# EAGLE schematic Data Logger V3.1 (EAGLE 9.4.0)
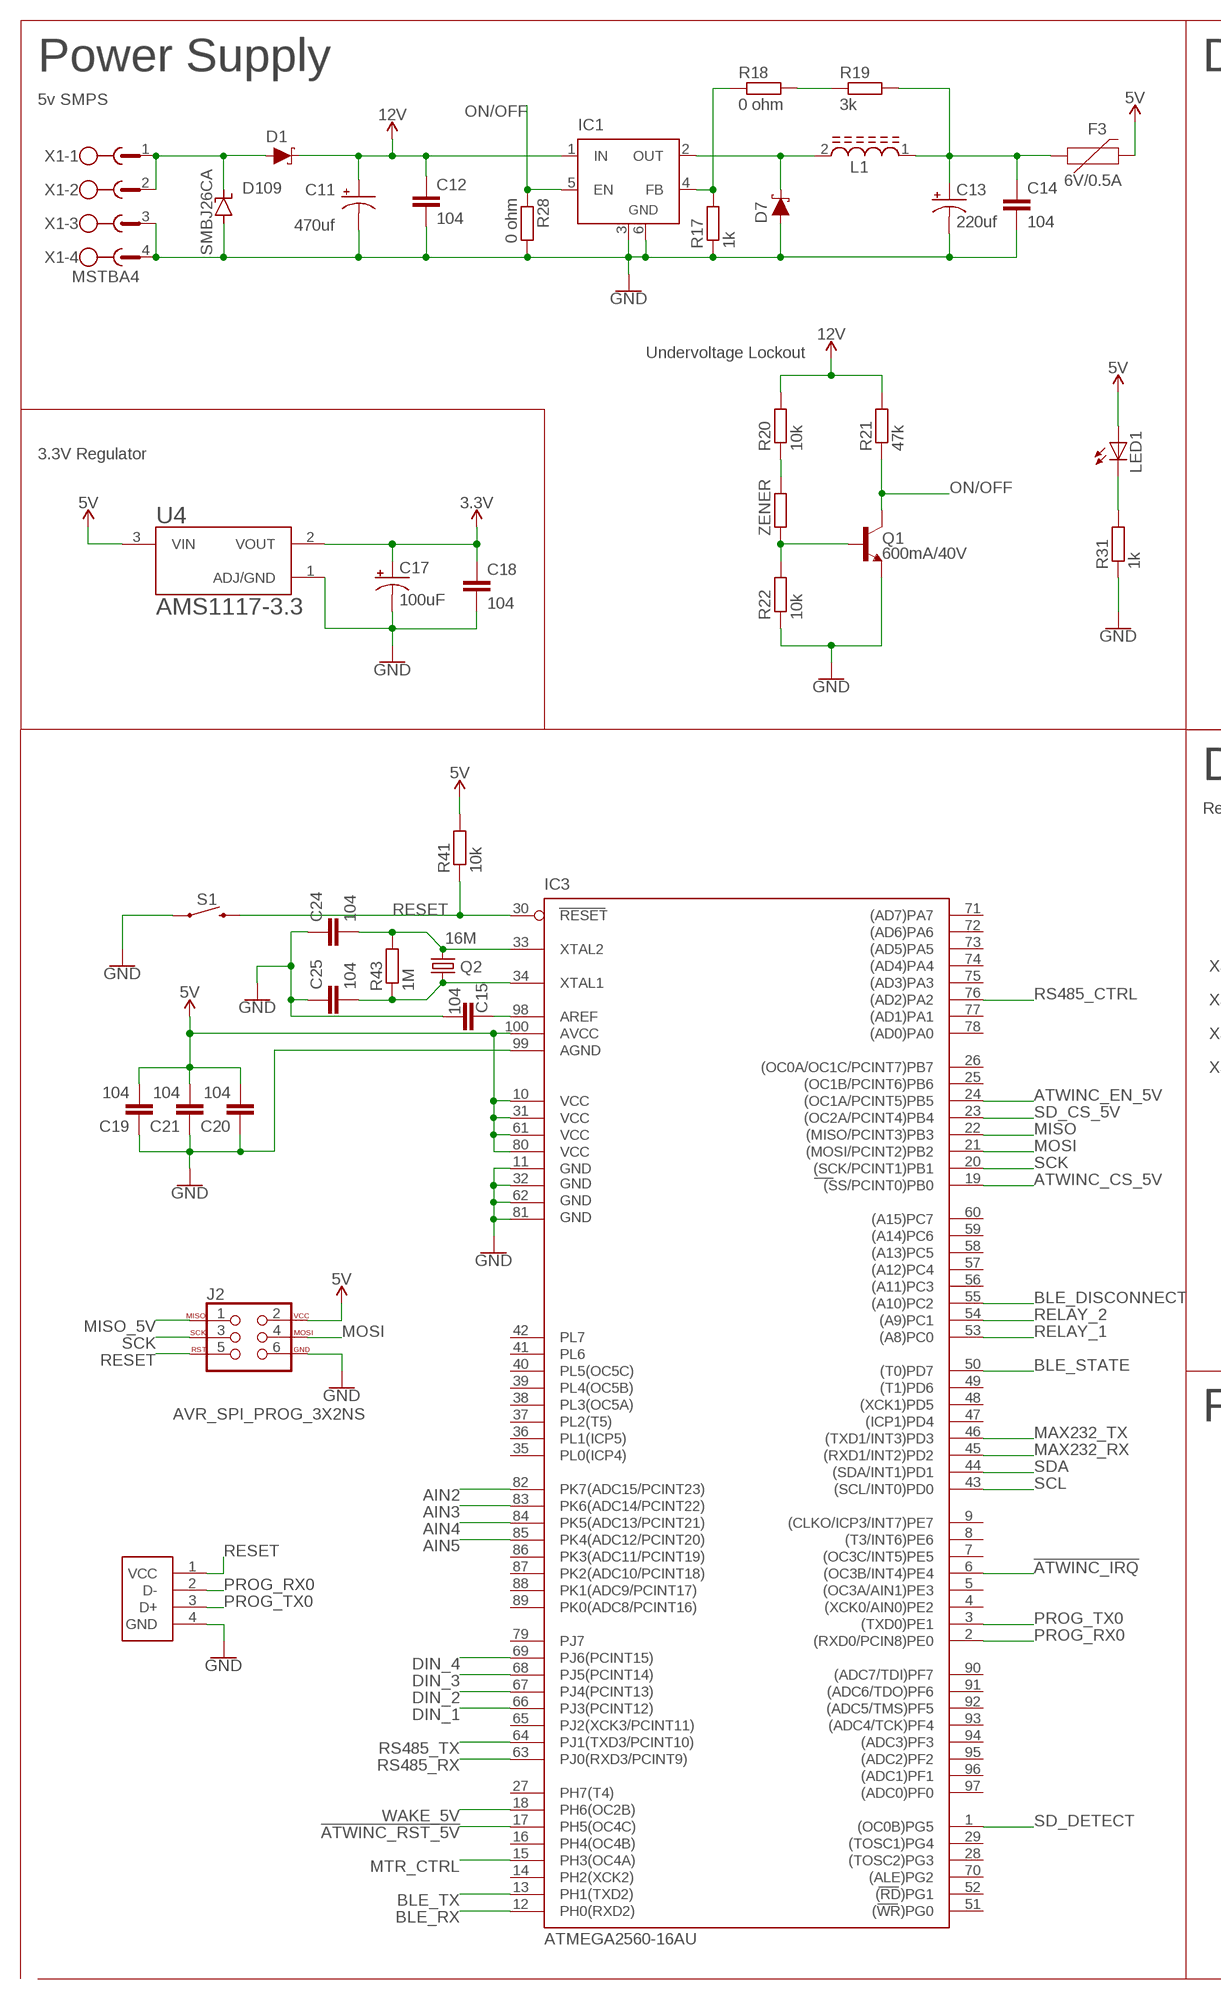
[diagram p0: schematic, sheet 1, part 1 of 3]
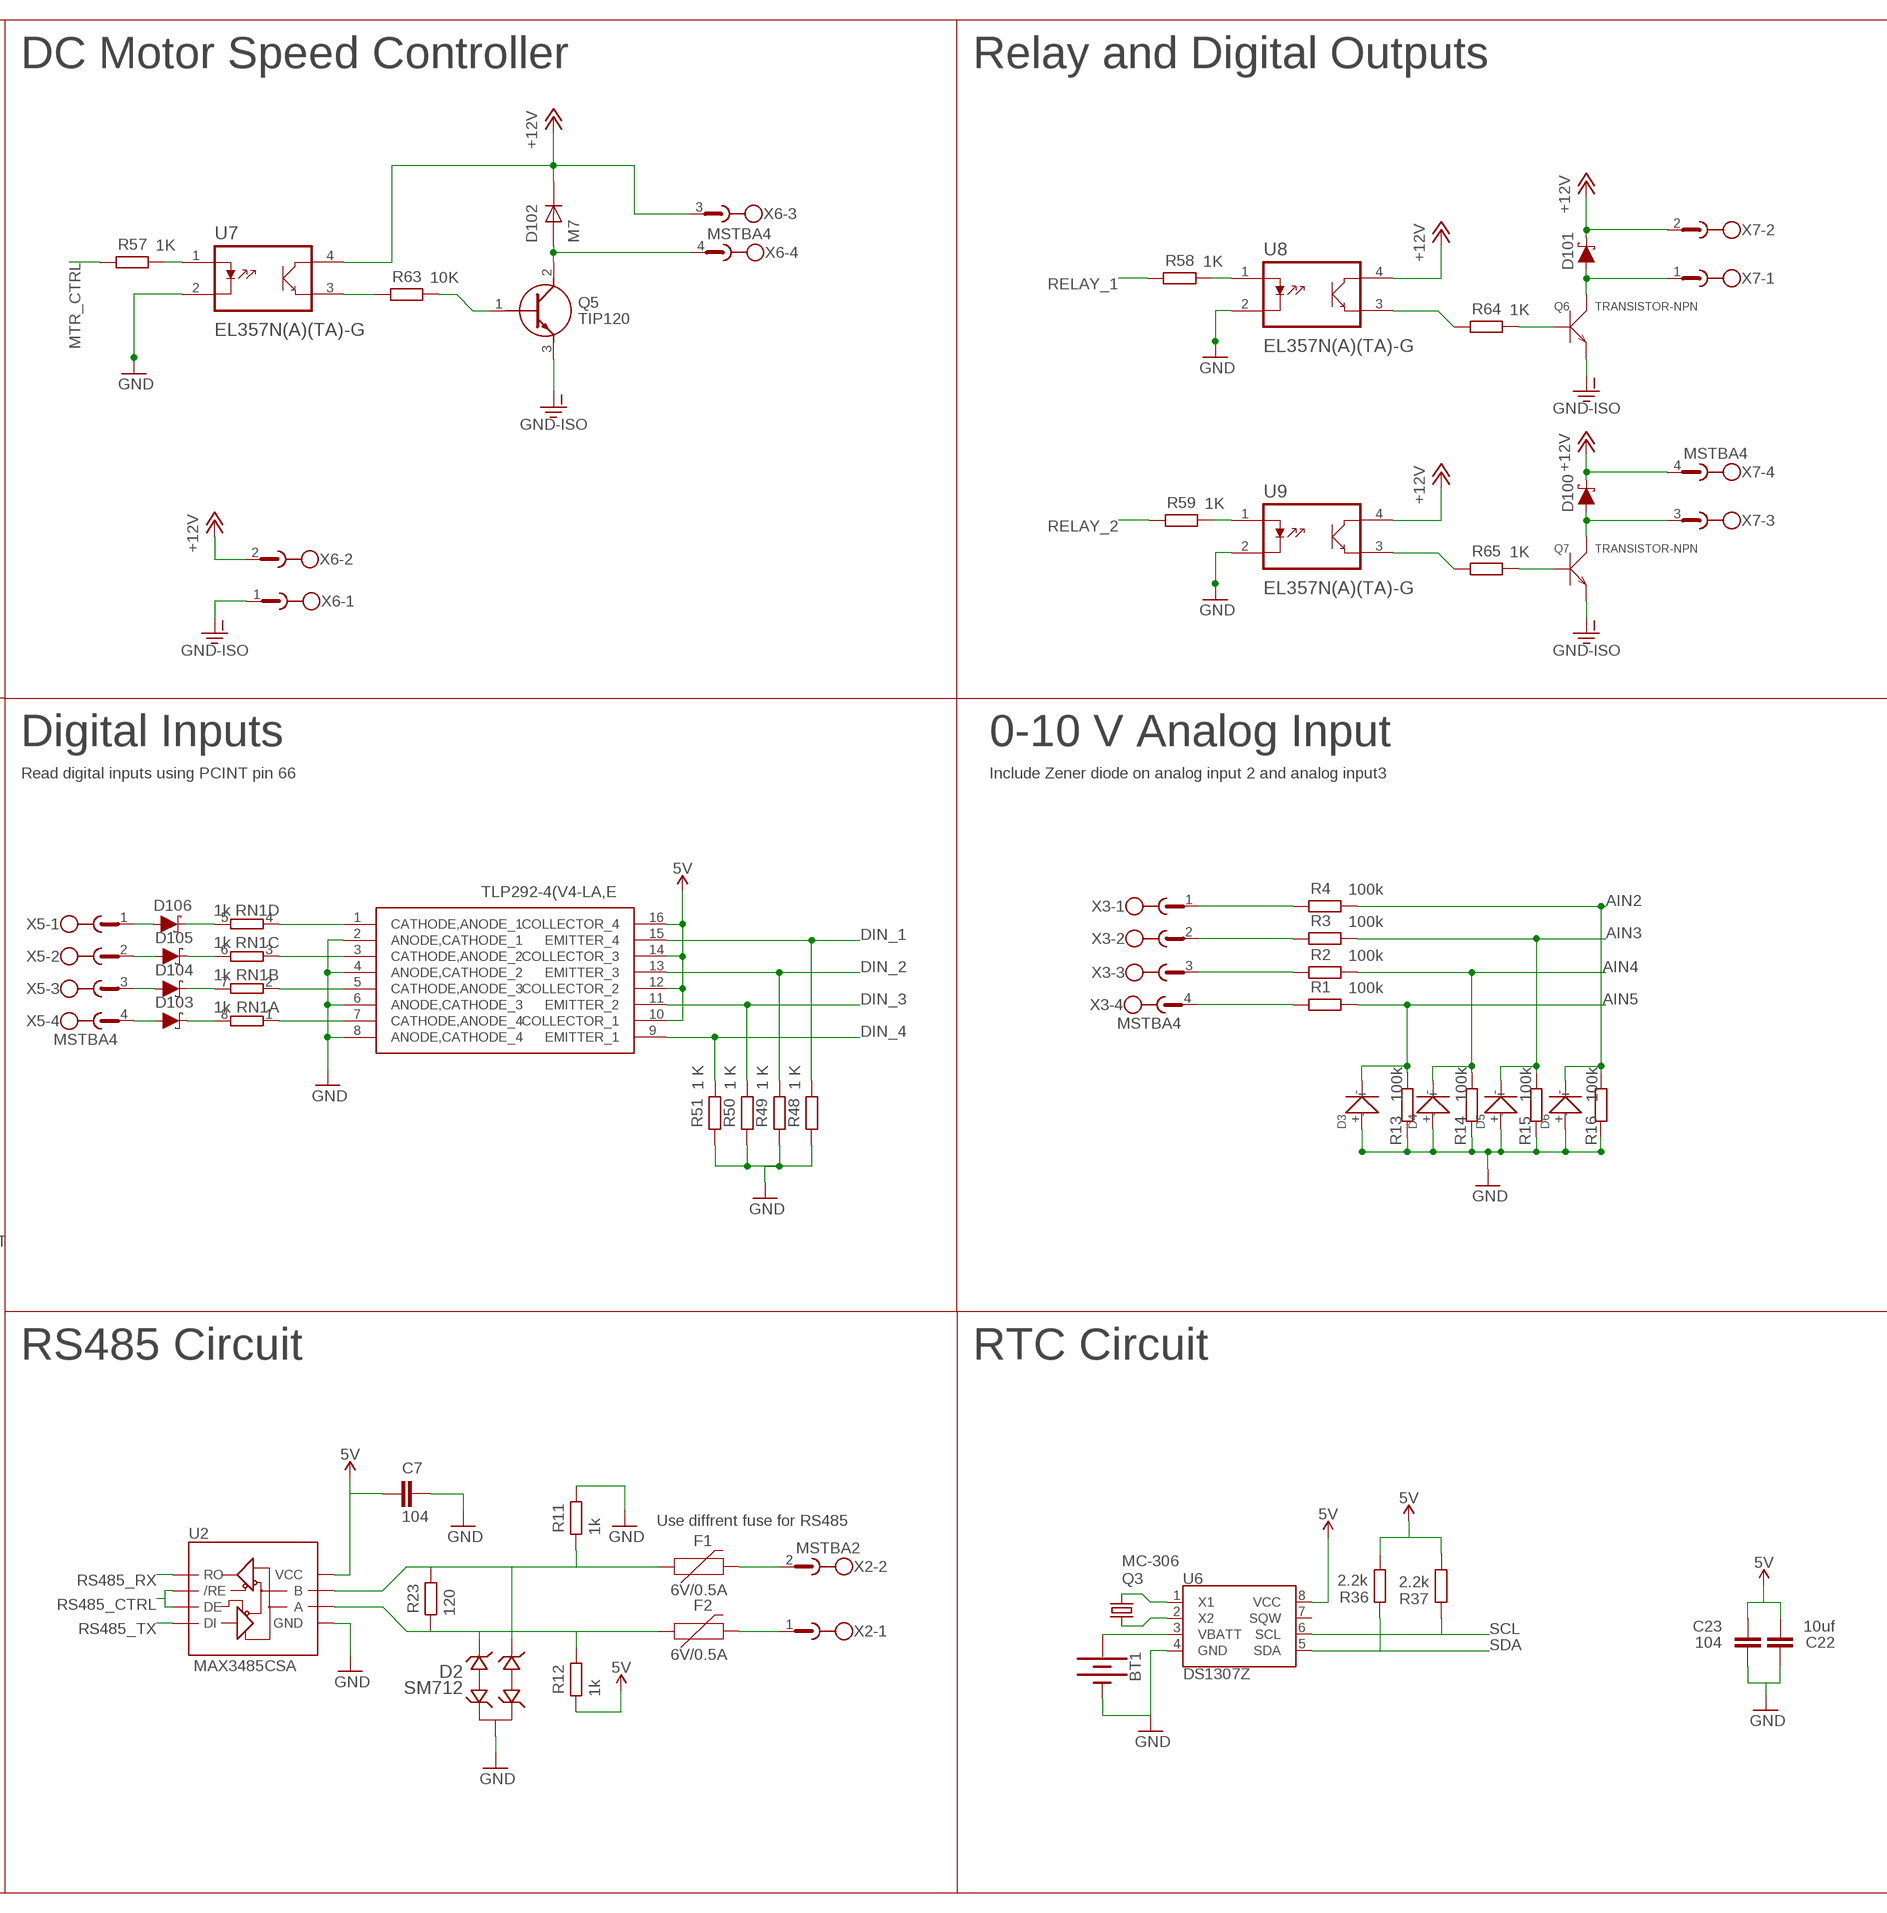
[diagram p1: schematic, sheet 1, part 2 of 3]
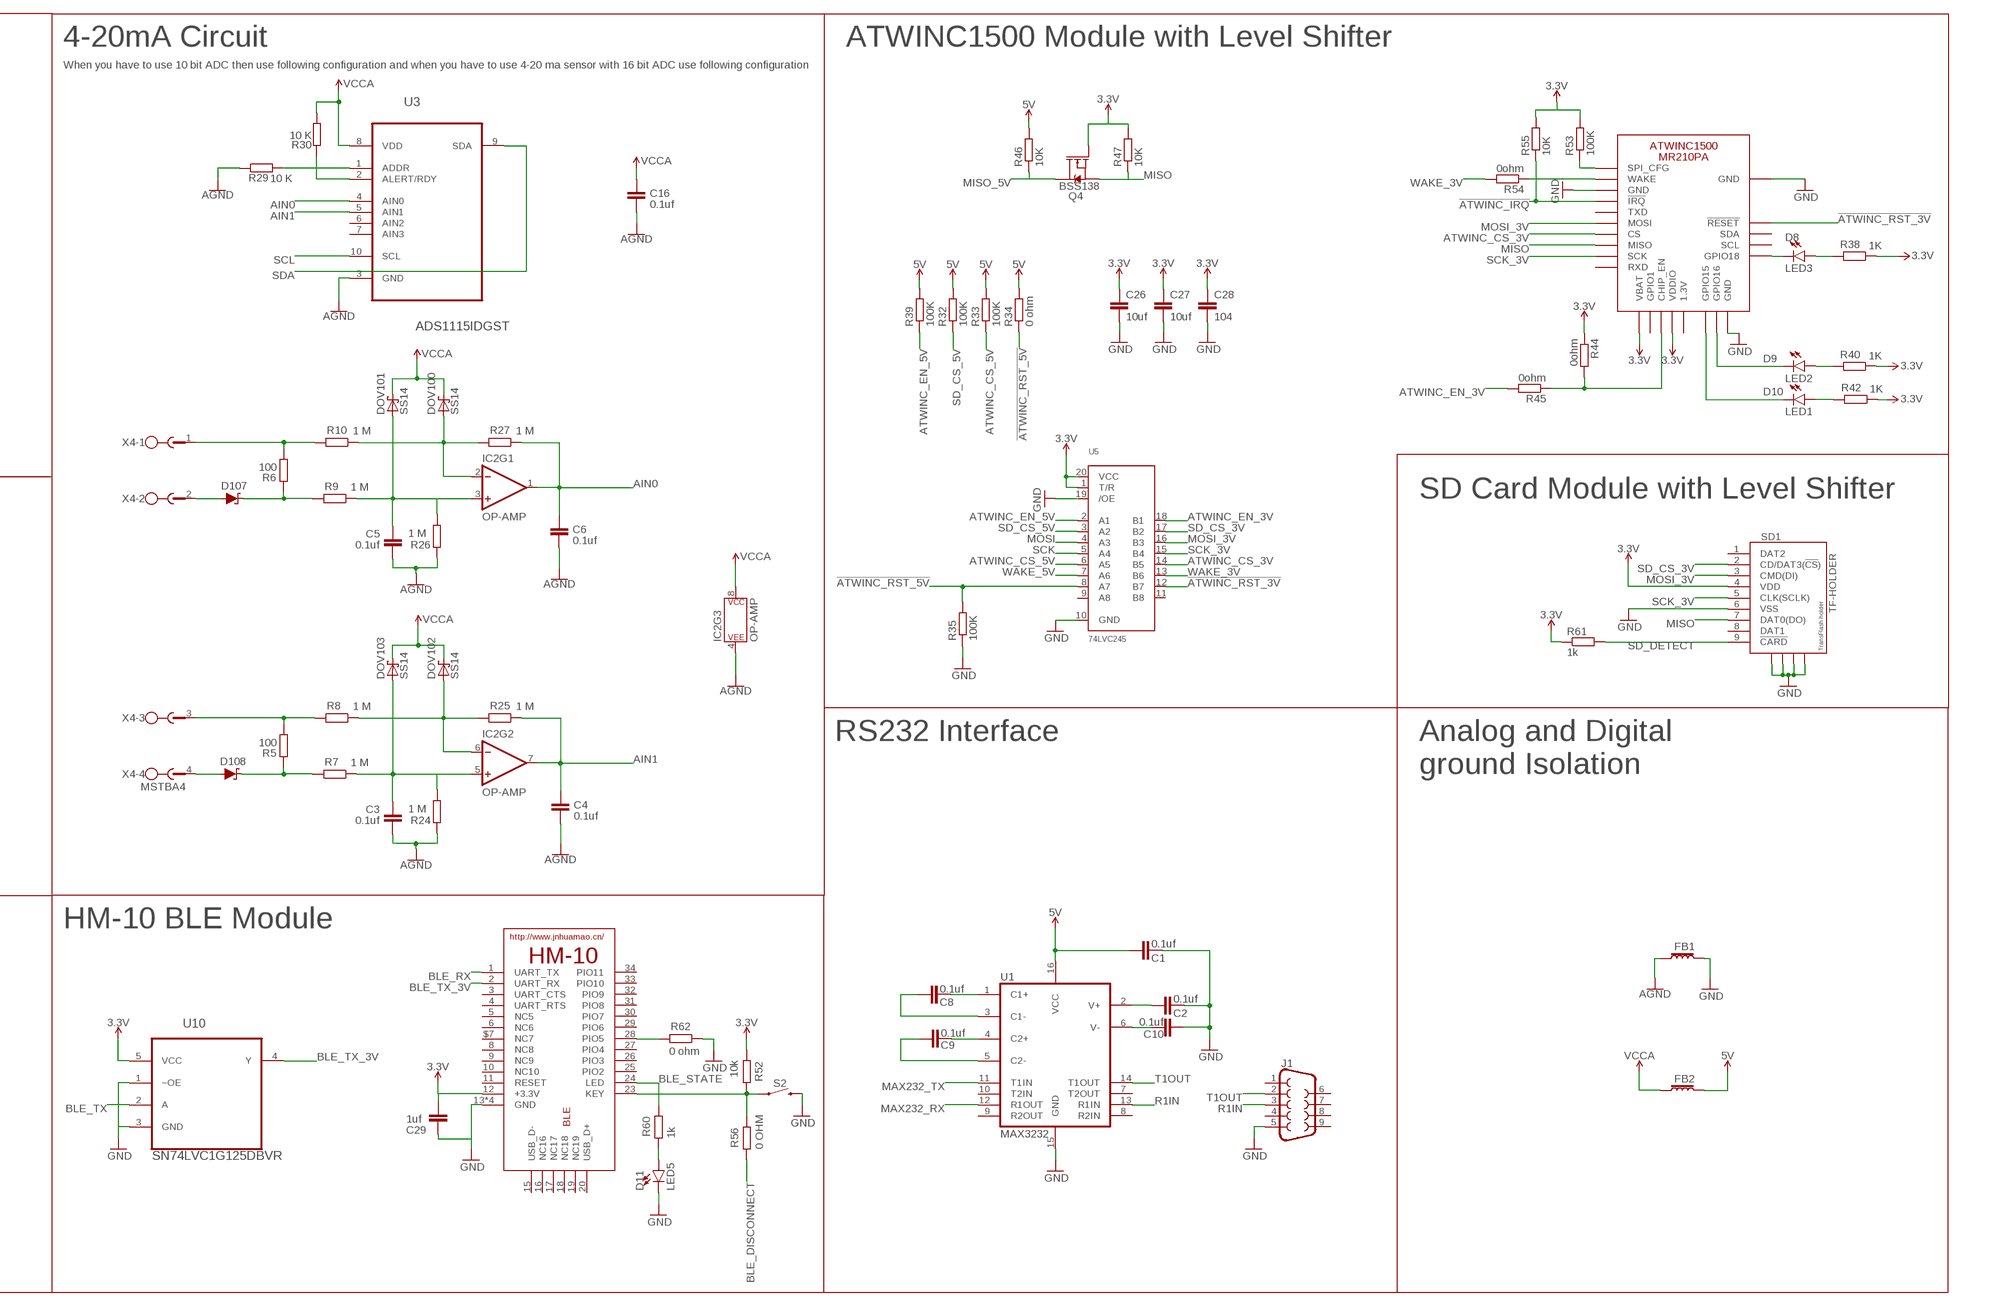
[diagram p2: schematic, sheet 1, part 3 of 3]

## Parts
BLE  HM-10-BOARD  [26.9X13X2.2_BOARD]
BT1  BATTERY-20MM_PTH  [BATTCOM_20MM_PTH]
C1  0.1uf  C-EUC0805  [C0805]
C2  0.1uf  C-EUC0805  [C0805]
C3  0.1uf  C-EUC0805  [C0805]
C4  0.1uf  C-EUC0805  [C0805]
C5  0.1uf  C-EUC0805  [C0805]
C6  0.1uf  C-EUC0805  [C0805]
C7  104  C-EUC0805  [C0805]
C8  0.1uf  C-EUC0805  [C0805]
C9  0.1uf  C-EUC0805  [C0805]
C10  0.1uf  C-EUC0805  [C0805]
C11  470uf  CPOL-USE5-8.5  [E5-8,5]
C12  104  C-EUC0805  [C0805]
C13  220uf  CPOL-US150CLZ-1014  [150CLZ-1014]
C14  104  C-EUC0805  [C0805]
C15  104  C-EUC0805  [C0805]
C16  0.1uf  C-EUC0805  [C0805]
C17  100uF  100UF-POLAR-25V-20%(ELEC)  [PANASONIC_D]
C18  104  C-EUC0805  [C0805]
C19  104  C-EUC0805  [C0805]
C20  104  C-EUC0805  [C0805]
C21  104  C-EUC0805  [C0805]
C22  10uf  C-EUC0805  [C0805]
C23  104  C-EUC0805  [C0805]
C24  104  C-EUC0805  [C0805]
C25  104  C-EUC0805  [C0805]
C26  10uf  C-EUC0805  [C0805]
C27  10uf  C-EUC0805  [C0805]
C28  104  C-EUC0805  [C0805]
C29  1uf  C-EUC0805  [C0805]
D1  3A/40V/500mV  DIODE-SCHOTTKY-B340A  [SMA-DIODE]
D2  SM712  CDSOT23-SM712  [SOT-23-3]
D3  SMD-DIODE-ZENER-5.1V-500MW(SOD-123)  [SOD-123]
D4  SMD-DIODE-ZENER-5.1V-500MW(SOD-123)  [SOD-123]
D5  SMD-DIODE-ZENER-5.1V-500MW(SOD-123)  [SOD-123]
D6  SMD-DIODE-ZENER-5.1V-500MW(SOD-123)  [SOD-123]
D7  3A/40V/500mV  DIODE-SCHOTTKY-B340A  [SMA-DIODE]
D8  LED3  LED-RED0603-SMART  [LED-0603]
D9  LED2  LED-GREEN0603  [LED-0603]
D10  LED1  LED-GREEN0603  [LED-0603]
D11  LED5  LED-GREEN0603  [LED-0603]
D100  3A/40V/500mV  DIODE-SCHOTTKY-B340A  [SMA-DIODE]
D101  3A/40V/500mV  DIODE-SCHOTTKY-B340A  [SMA-DIODE]
D102  M7  [DIOM505270X240]
D103  3A/40V/500mV  DIODE-SCHOTTKY-B340A  [SMA-DIODE]
D104  3A/40V/500mV  DIODE-SCHOTTKY-B340A  [SMA-DIODE]
D105  3A/40V/500mV  DIODE-SCHOTTKY-B340A  [SMA-DIODE]
D106  3A/40V/500mV  DIODE-SCHOTTKY-B340A  [SMA-DIODE]
D107  3A/40V/500mV  DIODE-SCHOTTKY-B340A  [SMA-DIODE]
D108  3A/40V/500mV  DIODE-SCHOTTKY-B340A  [SMA-DIODE]
D109  SMBJ26CA  SUPPRESSOR-SMBJ  [SMBJ]
DOV100  SS14  [DO-214AC]
DOV101  SS14  [DO-214AC]
DOV102  SS14  [DO-214AC]
DOV103  SS14  [DO-214AC]
F1  6V/0.5A  PPTC_HALF-AMP  [1206]
F2  6V/0.5A  PPTC_HALF-AMP  [1206]
F3  6V/0.5A  PPTC_HALF-AMP  [1206]
FB1  30Ω/1.8A  FERRITE_BEAD-0603  [0603]
FB2  30Ω/1.8A  FERRITE_BEAD-0603  [0603]
IC1  LM2596S  [TO263-5]
IC2  OP-AMP  OPAMP-DUALU  [SO08]
IC3  ATMEGA2560-16AU  ATMEGA25602560-16AU  [TQFP100]
IC4  TLP292-4(V4-LA,E  [SOIC127P700X230-16N]
J1  DB9MALE  [DB9_MALE]
J2  AVR_SPI_PROG_3X2NS  [2X3-NS]
L1  SRR1260-680M  [INDP125125X600N]
LED1  LEDCHIP-LED0805  [CHIP-LED0805]
PROG  61400416121  [61400416121]
Q1  600mA/40V  TRANS_NPN-MMBT2222AL  [SOT23-3]
Q2  16M  CRYSTALHC49US  [HC49US]
Q3  MC-306  [MC-306]
Q4  BSS138  MOSFET-NCH-AO3404A  [SOT23-3]
Q5  TIP120  [TO220]
Q6  TRANSISTOR-NPN  [SOT-23]
Q7  TRANSISTOR-NPN  [SOT-23]
R1  100k  R-EU_R0805  [R0805]
R2  100k  R-EU_R0805  [R0805]
R3  100k  R-EU_R0805  [R0805]
R4  100k  R-EU_R0805  [R0805]
R5  100  R-EU_R0805  [R0805]
R6  100  R-EU_R0805  [R0805]
R7  1 M  R-EU_R0805  [R0805]
R8  1 M  R-EU_R0805  [R0805]
R9  1 M  R-EU_R0805  [R0805]
R10  1 M  R-EU_R0805  [R0805]
R11  1k  R-EU_R0805  [R0805]
R12  1k  R-EU_R0805  [R0805]
R13  100k  R-EU_R0805  [R0805]
R14  100k  R-EU_R0805  [R0805]
R15  100k  R-EU_R0805  [R0805]
R16  100k  R-EU_R0805  [R0805]
R17  1k  R-EU_R0805  [R0805]
R18  0 ohm  R-EU_R0805  [R0805]
R19  3k  R-EU_R0805  [R0805]
R20  10k  R-EU_R0805  [R0805]
R21  47k  R-EU_R0805  [R0805]
R22  10k  R-EU_R0805  [R0805]
R23  120  R-EU_R0805  [R0805]
R24  1 M  R-EU_R0805  [R0805]
R25  1 M  R-EU_R0805  [R0805]
R26  1 M  R-EU_R0805  [R0805]
R27  1 M  R-EU_R0805  [R0805]
R28  0 ohm  R-EU_R0805  [R0805]
R29  10 K  R-EU_R0805  [R0805]
R30  10 K  R-EU_R0805  [R0805]
R31  1k  R-EU_R0805  [R0805]
R32  100K  R-EU_R0805  [R0805]
R33  100K  R-EU_R0805  [R0805]
R34  0 ohm  R-EU_R0805  [R0805]
R35  100K  R-EU_R0805  [R0805]
R36  2.2k  R-EU_R0805  [R0805]
R37  2.2k  R-EU_R0805  [R0805]
R38  1K  R-EU_R0805  [R0805]
R39  100K  R-EU_R0805  [R0805]
R40  1K  R-EU_R0805  [R0805]
R41  10k  R-EU_R0805  [R0805]
R42  1K  R-EU_R0805  [R0805]
R43  1M  R-EU_R0805  [R0805]
R44  0ohm  R-EU_R0805  [R0805]
R45  0ohm  R-EU_R0805  [R0805]
R46  10K  R-EU_R0805  [R0805]
R47  10K  R-EU_R0805  [R0805]
R48  1 K  R-EU_R0805  [R0805]
R49  1 K  R-EU_R0805  [R0805]
R50  1 K  R-EU_R0805  [R0805]
R51  1 K  R-EU_R0805  [R0805]
R52  10k  R-EU_R0805  [R0805]
R53  100K  R-EU_R0805  [R0805]
R54  0ohm  R-EU_R0805  [R0805]
R55  10K  R-EU_R0805  [R0805]
R56  0 OHM  R-EU_R0805  [R0805]
R57  1K  R-EU_R0805  [R0805]
R58  1K  R-EU_R0805  [R0805]
R59  1K  R-EU_R0805  [R0805]
R60  1k  R-EU_R0805  [R0805]
R61  1k  R-EU_R0805  [R0805]
R62  0 ohm  R-EU_R0805  [R0805]
R63  10K  R-EU_R0805  [R0805]
R64  1K  R-EU_R0805  [R0805]
R65  1K  R-EU_R0805  [R0805]
RN1  1k  4R-NCAY16  [CAY16]
S1  MOMENTARY-SWITCH-SPST-SMD-6.0X3.5MM  [TACTILE_SWITCH_SMD_6.0X3.5MM]
S2  MOMENTARY-SWITCH-SPST-SMD-6.0X3.5MM  [TACTILE_SWITCH_SMD_6.0X3.5MM]
SD1  TF-HOLDER  [TF-PULL]
U1  MAX3232  MAX2323SOIC16  [SO16]
U2  MAX3485CSA  RS485SOIC  [SO08]
U3  ADS1115IDGST  [SOP50P490X110-10N]
U4  AMS1117-3.3  [SOT229P700X180-4N]
U5  74LVC245  74LCX245  [TSSOP20]
U6  DS1307Z  [SO08-0.15]
U7  EL357N(A)(TA)-G  [SOP254P700X200-4N]
U8  EL357N(A)(TA)-G  [SOP254P700X200-4N]
U9  EL357N(A)(TA)-G  [SOP254P700X200-4N]
U10  SN74LVC1G125DBVR  [SOT95P280X145-5N]
WIFI  ATWINC1500_MR210PB  ATWINC1500_MR210PA  [ATWINC1500_MR210PA]
X1  MSTBA4  [MSTBA4]
X2  MSTBA2  [MSTBA2]
X3  MSTBA4  [MSTBA4]
X4  MSTBA4  [MSTBA4]
X5  MSTBA4  [MSTBA4]
X6  MSTBA4  [MSTBA4]
X7  MSTBA4  [MSTBA4]
ZENER  R0204/7  [0204/7]

## Nets
3.3V: BLE.12(+3.3V) C17.+ C18.1 C26.1 C27.1 C28.1 C29.2 Q4.1(G) R38.1 R40.1 R42.1 R44.1 R47.2 R52.2 R53.2 R55.2 R61.1 SD1.4(VDD) U4.2(VOUT) U5.1(T/R) U5.20(VCC) U10.5(VCC) WIFI.J20(VBAT) WIFI.J23(VDDIO)
5V: C1.2 C7.1 C19.2 C20.2 C21.2 C22.2 C23.2 F3.2 FB2.2 IC3.10(VCC) IC3.31(VCC1) IC3.61(VCC2) IC3.80(VCC3) IC3.100(AVCC) IC4.10(COLLECTOR_1) IC4.12(COLLECTOR_2) IC4.14(COLLECTOR_3) IC4.16(COLLECTOR_4) J2.2 LED1.A R12.2 R32.2 R33.2 R34.2 R36.1 R37.1 R39.2 R41.2 R46.2 U1.16(VCC) U2.8(VCC) U4.3(VIN) U6.8(VCC)
12V: C11.+ C12.1 D1.C IC1.1(IN) R20.2 R21.2
!ATWINC_IRQ: IC3.6((OC3B/INT4)PE4) R55.1 WIFI.J13(!IRQ)
!ATWINC_RST_3V: U5.12(B7) WIFI.J4(!RESET)
!ATWINC_RST_5V: IC3.17(PH5(OC4C)) R34.1 R35.2 U5.8(A7)
+12V: D100.C D101.C D102.C U7.4(C) U8.4(C) U9.4(C) X6.2 X6.3 X7.2 X7.4
AGND: C3.1 C4.1 C5.1 C6.1 C16.1 FB1.1 IC2.4(P$V-) R24.2 R26.2 R29.1 U3.3(GND)
AIN0: C6.2 IC2.1(OUT) R27.1 U3.4(AIN0)
AIN1: C4.2 IC2.7(OUT) R25.1 U3.5(AIN1)
AIN2: D6.- IC3.82(PK7(ADC15/PCINT23)) R4.1 R16.1
AIN3: D5.- IC3.83(PK6(ADC14/PCINT22)) R3.1 R15.1
AIN4: D4.- IC3.84(PK5(ADC13/PCINT21)) R2.1 R14.1
AIN5: D3.- IC3.85(PK4(ADC12/PCINT20)) R1.1 R13.1
AREF: C15.1 IC3.98(AREF)
ATWINC_CS_3V: U5.14(B5) WIFI.J16(CS)
ATWINC_CS_5V: IC3.19((SS/PCINT0)PB0) R33.1 U5.6(A5)
ATWINC_EN_3V: R45.2 U5.18(B1)
ATWINC_EN_5V: IC3.24((OC1A/PCINT5)PB5) R39.1 U5.2(A1)
BLE_DISCONNECT: IC3.55((A10)PC2) R56.2
BLE_RX: BLE.1(UART_TX) IC3.12(PH0(RXD2))
BLE_STATE: BLE.24(LED) IC3.50((T0)PD7) R60.1
BLE_TX: IC3.13(PH1(TXD2)) U10.2(A)
BLE_TX_3V: BLE.2(UART_RX) U10.4(Y)
DIN_1: IC3.66(PJ3(PCINT12)) IC4.15(EMITTER_4) R48.1
DIN_2: IC3.67(PJ4(PCINT13)) IC4.13(EMITTER_3) R49.1
DIN_3: IC3.68(PJ5(PCINT14)) IC4.11(EMITTER_2) R50.1
DIN_4: IC3.69(PJ6(PCINT15)) IC4.9(EMITTER_1) R51.1
GND: BLE.13(GND) BLE.14(GND) BLE.21(GND) BLE.22(GND) BT1.2(-) C1.1 C2.1 C7.2 C10.1 C11.- C12.2 C13.- C14.2 C15.2 C17.- C18.2 C19.1 C20.1 C21.1 C22.1 C23.1 C24.1 C25.1 C26.2 C27.2 C28.2 C29.1 D2.3(GND) D3.+ D4.+ D5.+ D6.+ D7.A D11.C D109.A FB1.2 IC1.3(GND) IC1.6(GND) IC3.11(GND) IC3.32(GND1) IC3.62(GND2) IC3.81(GND3) IC3.99(AGND) IC4.2(ANODE,CATHODE_1) IC4.4(ANODE,CATHODE_2) IC4.6(ANODE,CATHODE_3) IC4.8(ANODE,CATHODE_4) J1.5 J2.6 PROG.4(GND) Q1.2(E) R11.1 R13.2 R14.2 R15.2 R16.2 R17.1 R22.1 R28.2 R31.1 R35.1 R48.2 R49.2 R50.2 R51.2 R62.1 S1.1 S2.2 SD1.6(VSS) SD1.S1 SD1.S2 SD1.S3 SD1.S4 U1.15(GND) U2.5(GND) U4.1(ADJ/GND) U5.10(GND) U5.19(/OE) U6.4(GND) U7.2(K) U8.2(K) U9.2(K) U10.1(~OE) U10.3(GND) WIFI.J9(GND) WIFI.J12(GND) WIFI.J28(GND) WIFI.MTGND(GND) X1.3 X1.4
GND-ISO: Q5.3(E) Q6.2(E) Q7.2(E) X6.1
MAX232_RX: IC3.45((RXD1/INT2)PD2) U1.12(R1OUT)
MAX232_TX: IC3.46((TXD1/INT3)PD3) U1.11(T1IN)
MISO: IC3.22((MISO/PCINT3)PB3) Q4.2(S) R47.1 SD1.7(DAT0(DO)) WIFI.J17(MISO)
MISO_5V: J2.1 Q4.3(D) R46.1
MOSI: IC3.21((MOSI/PCINT2)PB2) J2.4 U5.4(A3)
MOSI_3V: SD1.3(CMD(DI)) U5.16(B3) WIFI.J15(MOSI)
MTR_CTRL: IC3.15(PH3(OC4A)) R57.2
N$1: C13.+ C14.1 F3.1 L1.1 R19.2
N$3: D8.C WIFI.J1(GPIO18)
N$4: R58.1 U8.1(A)
N$9: R4.2 X3.1
N$10: D9.C WIFI.J27(GPIO16)
N$11: D10.C WIFI.J26(GPIO15)
N$12: R53.1 WIFI.J10(SPI_CFG)
N$13: D10.A R42.2
N$14: D9.A R40.2
N$15: D8.A R38.2
N$18: D2.2(IO2) F1.1 R11.2 R23.1 U2.7(B)
N$19: D2.1(IO1) F2.1 R12.1 R23.2 U2.6(A)
N$20: R3.2 X3.2
N$21: BT1.1(+) U6.3(VBATT)
N$22: F1.2 X2.2
N$23: F2.2 X2.1
N$25: Q3.1 U6.1(X1)
N$26: Q3.4 U6.2(X2)
N$27: BLE.28(PIO5) R62.2
N$30: R2.2 X3.3
N$31: R59.1 U9.1(A)
N$32: R1.2 X3.4
N$33: R44.2 R45.1 WIFI.J22(CHIP_EN)
N$34: R54.1 WIFI.J11(WAKE)
N$35: BLE.23(KEY) R52.1 R56.1 S2.1
N$36: R30.1 U3.2(ALERT/RDY)
N$37: R29.2 U3.1(ADDR)
N$38: C5.2 DOV101.A IC2.3(+IN) R9.1 R26.1
N$39: R63.2 U7.3(E)
N$40: DOV100.A IC2.2(-IN) R10.1 R27.2
N$42: R6.1 R10.2 X4.1
N$44: D11.A R60.2
N$45: D108.A X4.4
N$48: Q5.1(B) R63.1
N$50: R64.2 U8.3(E)
N$51: D108.C R5.2 R7.2
N$52: D107.A X4.2
N$53: D103.A X5.4
N$54: D103.C RN1.8
N$55: D104.C RN1.7
N$56: D104.A X5.3
N$57: D105.A X5.2
N$58: C3.2 DOV103.A IC2.5(+IN) R7.1 R24.1
N$59: DOV102.A IC2.6(-IN) R8.1 R25.2
N$60: D105.C RN1.6
N$61: D107.C R6.2 R9.2
N$62: R65.2 U9.3(E)
N$63: R5.1 R8.2 X4.3
N$64: D106.C RN1.5
N$65: D106.A X5.1
N$66: R20.1 ZENER.2
N$67: R57.1 U7.1(A)
N$68: D102.A Q5.2(C) X6.4
N$69: D7.C IC1.2(OUT) L1.2
N$70: D1.A D109.C X1.1 X1.2
N$71: IC1.4(FB) R17.2 R18.1
N$72: R18.2 R19.1
N$73: Q1.1(B) R22.2 ZENER.1
N$74: LED1.C R31.2
N$75: C24.2 IC3.33(XTAL2) Q2.2 R43.2
N$76: C25.2 IC3.34(XTAL1) Q2.1 R43.1
N$92: IC4.1(CATHODE,ANODE_1) RN1.4
N$94: IC4.3(CATHODE,ANODE_2) RN1.3
N$96: IC4.5(CATHODE,ANODE_3) RN1.2
N$98: IC4.7(CATHODE,ANODE_4) RN1.1
N$112: C8.2 U1.1(C1+)
N$113: C8.1 U1.3(C1-)
N$114: C9.1 U1.4(C2+)
N$115: C9.2 U1.5(C2-)
N$116: C2.2 U1.2(V+)
N$117: C10.2 U1.6(V-)
N$122: Q6.1(B) R64.1
N$123: Q7.1(B) R65.1
N$126: D100.A Q7.3(C) X7.3
N$127: D101.A Q6.3(C) X7.1
ON/OFF: IC1.5(EN) Q1.3(C) R21.1 R28.1
PROG_RX0: IC3.2((RXD0/PCIN8)PE0) PROG.2(D-)
PROG_TX0: IC3.3((TXD0)PE1) PROG.3(D+)
R1IN: J1.3 U1.13(R1IN)
RELAY_1: IC3.53((A8)PC0) R58.2
RELAY_2: IC3.54((A9)PC1) R59.2
RESET: IC3.30(RESET) J2.5 PROG.1(VCC) R41.1 S1.2
RS485_CTRL: IC3.76((AD2)PA2) U2.2(/RE) U2.3(DE)
RS485_RX: IC3.63(PJ0(RXD3/PCINT9)) U2.1(RO)
RS485_TX: IC3.64(PJ1(TXD3/PCINT10)) U2.4(DI)
SCK: IC3.20((SCK/PCINT1)PB1) J2.3 U5.5(A4)
SCK_3V: SD1.5(CLK(SCLK)) U5.15(B4) WIFI.J18(SCK)
SCL: IC3.43((SCL/INT0)PD0) R37.2 U3.10(SCL) U6.6(SCL)
SD_CS_3V: SD1.2(CD/DAT3(!CS!)) U5.17(B2)
SD_CS_5V: IC3.23((OC2A/PCINT4)PB4) R32.1 U5.3(A2)
SD_DETECT: IC3.1((OC0B)PG5) R61.2 SD1.9(!CARD)
SDA: IC3.44((SDA/INT1)PD1) R36.2 U3.9(SDA) U6.5(SDA)
T1OUT: J1.2 U1.14(T1OUT)
VCCA: C16.2 DOV100.C DOV101.C DOV102.C DOV103.C FB2.1 IC2.8(P$V+) R30.2 U3.8(VDD)
WAKE_3V: R54.2 U5.13(B6)
WAKE_5V: IC3.18(PH6(OC2B)) U5.7(A6)
Unconnected: BLE.3(UART_CTS) BLE.4(UART_RTS) BLE.5(NC5) BLE.6(NC6) BLE.8(NC8) BLE.9(NC9) BLE.10(NC10) BLE.11(RESET) BLE.15(USB_D-) BLE.16(NC16) BLE.17(NC17) BLE.18(NC18) BLE.19(NC19) BLE.20(USB_D+) BLE.25(PIO2) BLE.26(PIO3) BLE.27(PIO4) BLE.29(PIO6) BLE.30(PIO7) BLE.31(PIO8) BLE.32(PIO9) BLE.33(PIO10) BLE.34(PIO11) BLE.$7(NC7) IC3.4((XCK0/AIN0)PE2) IC3.5((OC3A/AIN1)PE3) IC3.7((OC3C/INT5)PE5) IC3.8((T3/INT6)PE6) IC3.9((CLKO/ICP3/INT7)PE7) IC3.14(PH2(XCK2)) IC3.16(PH4(OC4B)) IC3.25((OC1B/PCINT6)PB6) IC3.26((OC0A/OC1C/PCINT7)PB7) IC3.27(PH7(T4)) IC3.28((TOSC2)PG3) IC3.29((TOSC1)PG4) IC3.35(PL0(ICP4)) IC3.36(PL1(ICP5)) IC3.37(PL2(T5)) IC3.38(PL3(OC5A)) IC3.39(PL4(OC5B)) IC3.40(PL5(OC5C)) IC3.41(PL6) IC3.42(PL7) IC3.47((ICP1)PD4) IC3.48((XCK1)PD5) IC3.49((T1)PD6) IC3.51((WR)PG0) IC3.52((RD)PG1) IC3.56((A11)PC3) IC3.57((A12)PC4) IC3.58((A13)PC5) IC3.59((A14)PC6) IC3.60((A15)PC7) IC3.65(PJ2(XCK3/PCINT11)) IC3.70((ALE)PG2) IC3.71((AD7)PA7) IC3.72((AD6)PA6) IC3.73((AD5)PA5) IC3.74((AD4)PA4) IC3.75((AD3)PA3) IC3.77((AD1)PA1) IC3.78((AD0)PA0) IC3.79(PJ7) IC3.86(PK3(ADC11/PCINT19)) IC3.87(PK2(ADC10/PCINT18)) IC3.88(PK1(ADC9/PCINT17)) IC3.89(PK0(ADC8/PCINT16)) IC3.90((ADC7/TDI)PF7) IC3.91((ADC6/TDO)PF6) IC3.92((ADC5/TMS)PF5) IC3.93((ADC4/TCK)PF4) IC3.94((ADC3)PF3) IC3.95((ADC2)PF2) IC3.96((ADC1)PF1) IC3.97((ADC0)PF0) J1.1 J1.4 J1.6 J1.7 J1.8 J1.9 SD1.1(DAT2) SD1.8(DAT1) U1.7(T2OUT) U1.8(R2IN) U1.9(R2OUT) U1.10(T2IN) U3.6(AIN2) U3.7(AIN3) U5.9(A8) U5.11(B8) U6.7(SQW) WIFI.J2(SCL) WIFI.J3(SDA) WIFI.J14(TXD) WIFI.J19(RXD) WIFI.J21(GPIO1) WIFI.J24(1.3V)

## Notes on the sheet
- Power Supply | DC Motor Speed Controller | Relay and Digital Outputs | 4-20mA Circuit | ATWINC1500 Module with Level Shifter
- 5v SMPS | When you have to use 10 bit ADC then use following configuration and when you have to use 4-20 ma sensor with 16 bit ADC use following configuration
- Undervoltage Lockout
- 3.3V Regulator
- SD Card Module with Level Shifter
- Digital Inputs | 0-10 V Analog Input
- Read digital inputs using PCINT pin 66 | Include Zener diode on analog input 2 and analog input3
- RS232 Interface
- Analog and Digital
  ground Isolation
- RS485 Circuit | RTC Circuit | HM-10 BLE Module
- Use diffrent fuse for RS485

## Library data of the parts
BLE = JNHuaMao:HM-10: HM Bluetooth module use TI CC2540 or CC2541, Master and slave roles in one, transmission version and remote control version and PIO state acquisition functions in one, Support the AT command modify module parameters, Convenient and flexible.
BT1 = SparkFun-Batteries:BATTERY: Battery - Single Cell A variety of battery chemistries, sizes, and footprints. Device List: 20MM_PTH - Coin Cell Battery Holder - 20mm (PTH) <https://www.sparkfun.com/products/783> 6.8MM_PTH - Coin Cell Battery Holder - 6.8MM(SMD) <https://www.digikey.com/product-detail/en/seiko-instruments/MS621FE-FL11E/728-1057-ND/1889208?WT.srch=1&gclid=CNOQ5a6LzdQCFZS2wAodXCkE0g> 12MM_SMD - Coin Cell Battery Holder - 12mm (SMD) <https://www.sparkfun.com/products/10592> 12MM_PTH - Coin Cell Battery Holder - 12mm (PTH) <https://www.sparkfun.com/products/7948> 20MM_SMD - 20mm Coin Cell Battery Holder (SMD) (2 legs) Used on the Big Time Watch Kit <https://www.sparkfun.com/products/11734> 20MM_SMD_4LEGS - Coin Cell Battery Holder - 20mm (SMD) <https://www.sparkfun.com/products/11892> 20MM_SMD_4LEGS_OVERPASTE - Coin Cell Battery Holder - 20mm (SMD) <https://www.sparkfun.com/products/11892> (Over-paste on the legs) 24.5MM_PTH - Coin Cell Battery Holder - 24.5mm (PTH) <https://www.sparkfun.com/products/8863> 9V - 9V Battery Holder - PC Mount Used on the SparkFun SparkPunk Sound Kit <https://www.sparkfun.com/products/11177> and SparkFun SparkPunk Sequencer Kit <https://www.sparkfun.com/products/12707> 18650 - Battery Holder - 18650 (PTH) <https://www.sparkfun.com/products/13113> AA - Battery Holder - 1xAA (PTH) <https://www.sparkfun.com/products/7949> AAA - Battery Holder - 1xAAA (PTH) <https://www.sparkfun.com/products/12718> AA_KIT - Battery Holder - 1xAA (PTH) <https://www.sparkfun.com/products/7949> Special kit package - pads only have exposed copper on one side of the board. AAA_KIT - Battery Holder - 1xAAA (PTH) <https://www.sparkfun.com/products/12718> Special kit package - pads only have exposed copper on one side of the board.; PROD_ID: BATT-09031; SF_SKU: PRT-00783
C1-C10 C12 C14-C16 C18-C29 = rcl:C-EU: CAPACITOR, European symbol; SPICEPREFIX: C
C11 C13 = adafruit:CPOL-US: POLARIZED CAPACITOR, American symbol
C17 = SparkFun-Capacitors:100UF-POLAR: 100µF polarized capacitors A capacitor is a passive two-terminal electrical component used to store electrical energy temporarily in an electric field.; PROD_ID: CAP-12547
D1 D7 D100 D101 D103-D108 = SparkFun-DiscreteSemi:DIODE-SCHOTTKY: Schottky diode A Schottky diode is a semiconductor diode which has a low forward voltage drop and a very fast switching action.; PROD_ID: DIO-09886
D2 = SM712 TVS RS485 Diode:CDSOT23-SM712: Bourns CDSOT23-SM712 http://www.bourns.com/docs/Product-Datasheets/CDSOT23-SM712.pdf TVS Protection Didoe for RS-485 as recommended by TI in their RS-485 Reference Guide: http://www.ti.com/lit/sg/slyt484a/slyt484a.pdf; AVAILABILITY: Unavailable; DESCRIPTION: Diode, Smt Tvs Array, 7vrwm & 12vrwm, Sot23 Package; MF: Bourns; MP: CDSOT23-SM712; PACKAGE: SOT-23 Bourns; PRICE: None
D3-D6 = SMD-DIODE-ZENER-5.1V-500MW_SOD-123_:SMD-DIODE-ZENER-5.1V-500MW(SOD-123): 304030015; AVAILABILITY: Unavailable; DESCRIPTION: SMD Diode Zener 51.V-500mW; MF: Vishay; MP: MMSZ4689-V-GS08; PACKAGE: SOD-123 Vishay; PRICE: None
D8 = SparkFun-LED:LED-RED: Red SMD LED Used in manufacturing of most products at SparkFun Packages: 0603 - SMD 0603 package [Product Link] <http://docs.avagotech.com/docs/AV02-0551EN> 0603 SMART - SMD 0603 SMART package ( more efficient and expensive)[Product Link] <http://www.osram-os.com/Graphics/XPic2/00077099_0.pdf> 1206 - SMD1206 package [Product Link] <https://www.sparkfun.com/datasheets/DevTools/LilyPad/Q150OVS4.pdff> SparkFun Products: Pro Mini 328 -5V <https://www.sparkfun.com/products/821> RedBoard <https://www.sparkfun.com/products/12757> IOIO-OTG <https://www.sparkfun.com/products/13613>; PROD_ID: DIO-11154; VALUE: Red
D9-D11 = SparkFun-LED:LED-GREEN: Green SMD LED Used in manufacturing of various products at SparkFun Packages: 0603 - SMD 0603 package [Product Link] <http://www.futureelectronics.com/en/technologies/semiconductors/optoelectronics/leds/Pages/9894312-LTST-C190GKT.aspx?CrossPart=HSMG-C190&IM=0> LilyPad 1206 - SMD1206 LilyPad package [Product Link] <http://www.futureelectronics.com/en/Technologies/Product.aspx?ProductID=IN150NGHARVATEKCORPORATION2049943&IM=0> 1206 - SMD1206 package [Product Link] <http://www.futureelectronics.com/en/technologies/semiconductors/optoelectronics/leds/Pages/8315665-LTST-C150KGKT.aspx?IM=0> 1206 Bottom Mount -SMD 1206 Bottom Mount [Product Link] <http://www.digikey.com/product-detail/en/lite-on-inc/LTST-C230KGKT/160-1456-1-ND/386854> SparkFun Products: Pro Mini 328 -5V <https://www.sparkfun.com/products/821> RedBoard <https://www.sparkfun.com/products/12757> MP3 Trigger <https://www.sparkfun.com/products/13720> Makey Makey <https://www.sparkfun.com/products/11076>; PROD_ID: DIO-00821; VALUE: GREEN
D102 = M7:M7: none; AVAILABILITY: Unavailable; MF: Diodes Inc.; MP: M7; PACKAGE: DO-214 Diodes Inc.; PRICE: None
D109 = diode:SUPPRESSOR-: Suppressor diode
DOV100-DOV103 = SS14:SS14; AVAILABILITY: Unavailable; DESCRIPTION: SS14 Series 500 mV 1 A 40 V Max Reverse Voltage Schottky Rectifier - DO-214AC; MF: ON Semiconductor; MP: SS14; PACKAGE: DO-214AC-214 ON Semiconductor; PRICE: None
F1-F3 = SparkFun-Fuses:PPTC: Resettable Fuse PPTC Resettable Fuse. Really a sort of resistor with a polymeric positive temperature coefficient whose resistance increases dramatically with an increase in temperature. When heated by the power passing through the resistance rises causing the current to be limited, protecting the circuit. This is achieved by the transition of the polymer from a crystalline to an amorphous state where the conductive carbon separates breaking the conductive pathways found in the cool crystalline structure. When a PPTC cools back down it resumes conducting letting the circuit turn back on. SparkFun Products: SparkFun RedBoard - Programmed with Arduino <https://www.sparkfun.com/products/12757> Pro Micro - 5V/16MHz <https://www.sparkfun.com/products/12640> Arduino Pro 328 - 5V/16MHz <https://www.sparkfun.com/products/10915> MP3 Trigger <https://www.sparkfun.com/products/13720>; PROD_ID: RES-08585
FB1 FB2 = SparkFun-Coils:FERRITE_BEAD: Ferrite Bead (blocks, cores, rings, chokes, etc.) Inductor with layers of ferrite used to suppress high frequencies. Often used to isolate high frequency noise. SparkFun Products: IOIO-OTG - V2.2 <https://www.sparkfun.com/products/13613> SparkFun SAMD21 Mini Breakout <https://www.sparkfun.com/products/13664> SparkFun 6 Degrees of Freedom Breakout - LSM6DS3 <https://www.sparkfun.com/products/13339> SparkFun SAMD21 Dev Breakout <https://www.sparkfun.com/products/13672>; PROD_ID: NDUC-07859
IC1 = linear:LM2596S: STEP-DOWN VOLTAGE REGULATOR
IC2 = SparkFun-IC-Amplifiers:OPAMP-DUAL: Generic op-amp footprint This component is for the standard 358 pinning of a dual op-amp From the LM358 datasheet: Pin 1: Output A Pin 2: Inverting Input A Pin 3: Non-Inverting Input A Pin 4: Gnd Pin 5: Non-Inverting Input B Pin 6: Inverting Input B Pin 7: Output B Pin 8: V+; PROD_ID: NA-XXXXX
IC3 = SmartPrj:ATMEGA2560: MICROCONTROLLER 64/128/256 Kbytes FLASH 4 Kbytes EEPROM 8 Kbytes SRAM 86 General Purpose I/O pins 12-channels16-bit PWM 4 x Serial USARTs 16-channels 10-bit A/D
IC4 = TLP292-4(V4-LA_E:TLP292-4(V4-LA,E: Transistor Output Optocouplers 4ch Transistor opto coupler Source: Datasheet <https://toshiba.semicon-storage.com/info/docget.jsp?did=15284&prodName=TLP292-4>; DESCRIPTION: Transistor Output Optocouplers 4ch Transistor opto coupler; HEIGHT: 2.3mm; MANUFACTURER_NAME: Toshiba; MANUFACTURER_PART_NUMBER: TLP292-4(V4-LA,E; MOUSER_PART_NUMBER: 757-TLP292-4V4-LAE; MOUSER_PRICE-STOCK: https://www.mouser.com/Search/Refine.aspx?Keyword=757-TLP292-4V4-LAE
J1 = SparkFun-Connectors:DB9: DB9 Connector Standard DB9 (D-Sub 9) serial connector. Can be used for CAN bus as well as RS485 and RS232. Footprint production proven. Here is the female version connector we sell at SparkFun: 9 Pin Female Serial Connector - PCB Mount <https://www.sparkfun.com/products/429> (PRT-00429) This connector has been used on the following SparkFun products: SparkFun RS232 Shifter - SMD <https://www.sparkfun.com/products/449> (PRT-00449) SparkFun RS232 Shifter SMD (No DB9) <https://www.sparkfun.com/products/8780> (PRT-08780); PROD_ID: CONN-09904
J2 = SparkFun-Connectors:AVR_SPI_PROG_3X2: AVR ISP 6 Pin This is the reduced ISP connector for AVR programming. Common on Arduino. This footprint will take up less PCB space and can be used with a 10-pin to 6-pin adapter such as SKU: BOB-08508 **Special note about "TEST_POINT" package. The stop mask is on the top side, so if you want your programming test points to be on the bottom of your board, make sure to place this package on the bottom side of the board. This also ensure that the orientation to program from the bottom side will be correct. SparkFun Products: SparkFun ISP Pogo Adapter <https://www.sparkfun.com/products/11591> - NS Tiny AVR Programmer <https://www.sparkfun.com/products/11801> -PTH
L1 = 68uh SMPS Inductor:SRR1260-680M: Inductor Power Shielded Wirewound 33uH 20% 100KHz 27Q-Factor Ferrite 3A 60mOhm DCR T/R; AVAILABILITY: Unavailable; DESCRIPTION: Inductor Power Shielded Wirewound 68uH 20% 100KHz 22Q-Factor Ferrite 2.1A 110mOhm DCR T/R; MF: Bourns - J.W. Miller; MP: SRR1260-680M; PACKAGE: Nonstandard Bourns - J.W. Miller; PRICE: None
LED1 = adafruit:LED: LED OSRAM: - CHIPLED LG R971, LG N971, LY N971, LG Q971, LY Q971, LO R971, LY R971 LH N974, LH R974 LS Q976, LO Q976, LY Q976 LO Q996 - Hyper CHIPLED LW Q18S LB Q993, LB Q99A, LB R99A - SideLED LS A670, LO A670, LY A670, LG A670, LP A670 LB A673, LV A673, LT A673, LW A673 LH A674 LY A675 LS A676, LA A676, LO A676, LY A676, LW A676 LS A679, LY A679, LG A679 - Hyper Micro SIDELED® LS Y876, LA Y876, LO Y876, LY Y876 LT Y87S - SmartLED LW L88C, LW L88S LB L89C, LB L89S, LG L890 LS L89K, LO L89K, LY L89K LS L896, LA L896, LO L896, LY L896 - TOPLED LS T670, LO T670, LY T670, LG T670, LP T670 LSG T670, LSP T670, LSY T670, LOP T670, LYG T670 LG T671, LOG T671, LSG T671 LB T673, LV T673, LT T673, LW T673 LH T674 LS T676, LA T676, LO T676, LY T676, LB T676, LH T676, LSB T676, LW T676 LB T67C, LV T67C, LT T67C, LS T67K, LO T67K, LY T67K, LW E67C LS E67B, LA E67B, LO E67B, LY E67B, LB E67C, LV E67C, LT E67C LW T67C LS T679, LY T679, LG T679 LS T770, LO T770, LY T770, LG T770, LP T770 LB T773, LV T773, LT T773, LW T773 LH T774 LS E675, LA E675, LY E675, LS T675 LS T776, LA T776, LO T776, LY T776, LB T776 LHGB T686 LT T68C, LB T68C - Hyper Mini TOPLED® LB M676 - Mini TOPLED Santana® LG M470 LS M47K, LO M47K, LY M47K Source: http://www.osram.convergy.de/
PROG = Wuerth_Elektronik_eiCan_Communication_Connectors_v2.2:61400416121: WR-COM Horizontal USB Type B
Q1 = SparkFun-DiscreteSemi:TRANS_NPN: NPN transistor Current controlled devices typically used to amplify current or used as a switch. BC547 - COM-08928 <http://www.sparkfun.com/products/8928> (TO-92 45V 100mA) (1.Collector 2.Base 3.Emitter) 2N3904 - COM-00521 <http://www.sparkfun.com/products/521> (TO-92 40V 200mA) (1.Emitter 2.Base 3.Collector) P2N2222A - COM-12852 <http://www.sparkfun.com/products/12852> (TO-92 40V 600mA) (1.Collector 2.Base 3.Emitter); PROD_ID: TRANS-08049
Q2 = ilabs:CRYSTAL: Crystals Various standard crystals. Proven footprints. Spark Fun Electronics SKU : COM-00534
Q3 = crystal:MC-306: kHz RANGE CRYSTAL UNIT SMD Source: MC-306_405_406_E07X.PDF Homepage <http://www.epsontoyocom.co.jp>; MPN: MC-306 60.0KHZ 100PPM ,12.5PF; OC_FARNELL: 1278040; OC_NEWARK: 31M5576
Q4 = SparkFun-DiscreteSemi:MOSFET-NCH: N-channel MOSFETs Voltage controlled devices that allow control of high current outputs. SparkFun Products: SparkFun OpenScale <https://www.sparkfun.com/products/13261> SparkFun Digital Sandbox <https://www.sparkfun.com/products/12651> SparkFun Monster Moto Shield <https://www.sparkfun.com/products/10182> SparkFun MOSFET Power Controller <https://www.sparkfun.com/products/11214>; PROD_ID: TRANS-12988; VALUE: 5.8A/30V/35mΩ
Q5 = TIP120:TIP120: NPN Darlington Transistor Source: Datasheet <https://www.fairchildsemi.com/datasheets/TI/TIP120.pdf>; DESCRIPTION: NPN Darlington Transistor; HEIGHT: mm; MANUFACTURER_NAME: Fairchild Semiconductor; MANUFACTURER_PART_NUMBER: TIP120; MOUSER_PART_NUMBER: 512-TIP120; MOUSER_PRICE-STOCK: https://www.mouser.com/Search/Refine.aspx?Keyword=512-TIP120; RS_PART_NUMBER: 512-TIP120; RS_PRICE-STOCK: https://www.mouser.com/Search/Refine.aspx?Keyword=512-TIP120
Q6 Q7 = BC817_SOT-23:TRANSISTOR-NPN*: NPN Transistor; AVAILABILITY: Unavailable; DESCRIPTION: PS NPN transistor BC817-40 0.5A Ic 1Vce; MF: STMicroelectronics; MP: BC817-40; PACKAGE: SOT-23 NXP Semiconductors; PRICE: None
R1-R16 R23-R27 R29 R30 R36 R37 R48-R52 R56-R60 R62-R65 = resistor:R-EU_: RESISTOR, European symbol
R17-R22 R28 R31-R35 R38-R47 R53-R55 R61 = rcl:R-EU_: RESISTOR, European symbol; SPICEPREFIX: R
RN1 = resistor-dil:4R-N: Array Chip Resistor Source: RS Component / Phycomp; OC_FARNELL: unknown; OC_NEWARK: unknown
S1 S2 = SparkFun-Switches:MOMENTARY-SWITCH-SPST: Momentary Switch (Pushbutton) - SPST Normally-open (NO) SPST momentary switches (buttons, pushbuttons). Variants PTH-12MM - 12mm square, through-hole Momentary Pushbutton Switch - 12mm Square <https://www.sparkfun.com/products/9190> (COM-09190) PTH-6.0MM, PTH-6.0MM-KIT - 6.0mm square, through-hole Mini Pushbutton Switch <https://www.sparkfun.com/products/97> (COM-00097) KIT package intended for soldering kit's - only one side of pads' copper is exposed. PTH-RIGHT-ANGLE-KIT - Right-angle, through-hole Right Angle Tactile Button <https://www.sparkfun.com/products/10791> - Used on SparkFun BigTime Watch Kit <https://www.sparkfun.com/products/11734> SMD-12MM - 12mm square, surface-mount Tactile Button - SMD (12mm) <https://www.sparkfun.com/products/12993> (COM-12993) Used on SparkFun PicoBoard <https://www.sparkfun.com/products/11888> SMD-4.5MM - 4.5mm Square Trackball Switch Used on SparkFun Blackberry Trackballer Breakout <https://www.sparkfun.com/products/13169> SMD-4.6MMX2.8MM - 4.60mm x 2.80mm, surface mount Used on SparkFun SAMD21 Mini Breakout <https://www.sparkfun.com/products/13664> SMD-5.2MM, SMD-5.2-REDUNDANT - 5.2mm square, surface-mount Mini Pushbutton Switch - SMD <https://www.sparkfun.com/products/8720> (COM-08720) Used on Arduino Pro Mini <https://www.sparkfun.com/products/11114> REDUNDANT package connects both switch circuits together SMD-6.0X3.5MM - 6.0 x 3.5mm, surface mount Momentary Reset Switch SMD <https://www.sparkfun.com/products/8229> (COM-08229) SMD-6.2MM-TALL - 6.2mm square, surface mount Tactile Button - SMD (6mm) <https://www.sparkfun.com/products/12992> Used on SparkFun Digital Sandbox <https://www.sparkfun.com/products/12651> SMD-RIGHT-ANGLE - Right-angle, surface mount Used on SparkFun Block for Intel® Edison - Arduino <https://www.sparkfun.com/products/13036>; PROD_ID: SWCH-00815; SF_SKU: COM-08229
SD1 = sd-mmc:TF-HOLDER: TF / Micro SD socket is PUSH-PUSH type, the card can be pushed into and auto locked and pushed out by simply press the card. Surface Mounting type.
U1 = SparkFun-IC-Comms:MAX2323: RS232 Transceiver This part covers 232 drivers that are compatible with the MAX3232. Sipex SP3232EB Datasheet <http://cdn.sparkfun.com/datasheets/Components/General%20IC/SP3232EBCA-L.pdf> SparkFun Products SOIC component <https://www.sparkfun.com/products/589> (COM-00589 / IC-08171) Retired DIP component (COM-00316 / IC-08446) SparkFun Transceiver Breakout - MAX3232 <https://www.sparkfun.com/products/11189> (BOB-11189) SparkFun XBee Explorer Serial <https://www.sparkfun.com/products/13225> (WRL-13225); PROD_ID: IC-08171
U2 = SparkFun-IC-Comms:RS485: RS-485 Transceiver SP3485 Series 8 Pin NSOIC 3.3 V Low Power Half Duplex RS-485 Transceiver MAX3485 compatible Datasheet <http://www.sparkfun.com/datasheets/Components/General/sp3485CN-LTR.pdf> SparkFun Products SparkFun Transceiver Breakout - RS-485 <https://www.sparkfun.com/products/10124> (BOB-10124) SparkFun USB to RS-485 Converter <https://www.sparkfun.com/products/9822> (BOB-09822); PROD_ID: IC-09388
U3 = ADS1115IDGST:ADS1115IDGST: Analog-to-Digital Converter with Internal Reference; AVAILABILITY: Unavailable; DESCRIPTION: 16-Bit ADC with Integrated MUX, PGA, Comparator, Oscillator, and Reference 10-VSSOP -40 to 125; MF: Texas Instruments; MP: ADS1115IDGST; PACKAGE: MSOP-10 Texas Instruments; PRICE: None
U4 = AMS1117-3.3:AMS1117-3.3: Sot223/Pkg 1-Amp 3.3-Volt Low Drop Out Voltage Regulatator; AVAILABILITY: Unavailable; DESCRIPTION: Sot223/Pkg 1-Amp 3.3-Volt Low Drop Out Voltage Regulatator; MF: Advanced Monolithic Systems; MP: AMS1117-3.3; PACKAGE: None; PRICE: None
U5 = microbuilder:74LCX245: 74LCX245MTC - 5.0V Tolerant Bi-Directional Buffer Can be used to interface 5.0V logic to 2.5 or 3.3V devices Digikey: 74LCX245MTCXTR-ND Mouser: 512-74LCX245MTCX
U6 = SparkFun-Clocks:DS1307: Maxim DS1307 - I2C Real-time clock (RTC) The DS1307 serial real-time clock (RTC) is a low-power, full binary-coded decimal (BCD) clock/calendar plus 56 bytes of NV SRAM. Address and data are transferred serially through an I2C, bidirectional bus. The clock/calendar provides seconds, minutes, hours, day, date, month, and year information. SparkFun Products: Real Time Clock Module <https://www.sparkfun.com/products/12708> (BOB-12708) Datasheet <https://cdn.sparkfun.com/datasheets/BreakoutBoards/DS1307.pdf>; PROD_ID: IC-08138
U7-U9 = EL357N_A__TA_-G:EL357N(A)(TA)-G: Optocoupler [Everlight Electronics] EL357N(A)(TA)-G Optocoupler; AVAILABILITY: Unavailable; DESCRIPTION: Optocoupler [Everlight Electronics] EL357N_A__TA_-G Optocoupler; MF: Everlight; MP: EL357N_A__TA_-G; PACKAGE: SOP-4 Everlight; PRICE: None
U10 = SN74LVC1G125DBVR:SN74LVC1G125DBVR: SINGLE BUS BUFFER GATE WITH 3-STATE OUTPUT; AVAILABILITY: Unavailable; DESCRIPTION: Buffer/Line Driver 1-CH Non-Inverting 3-ST CMOS Medical 5-Pin SOT-23 T/R; MF: Texas Instruments; MP: SN74LVC1G125DBVR; PACKAGE: SOT-23-5 Texas Instruments; PRICE: None
WIFI = microbuilder:ATWINC1500_MR210PA: ATWINC1500_MR210PA wifi module
X1 X3-X7 = con-phoenix-508:MSTBA4: PHOENIX; MF: FARNELL; MPN: 1757268; OC_FARNELL: 3705195; OC_NEWARK: 71C4163
X2 = con-phoenix-508:MSTBA2: PHOENIX; MF: FARNELL; MPN: 1757242; OC_FARNELL: 3705171; OC_NEWARK: 71C4161
ZENER = eagle-ltspice:R: RESISTOR, European symbol; SPICEMODEL: NONE; SPICEPREFIX: R